# Altium schematic sheet M5_CORE2_re.SchDoc
size A2; SheetNumber: 1; SheetTotal: 1
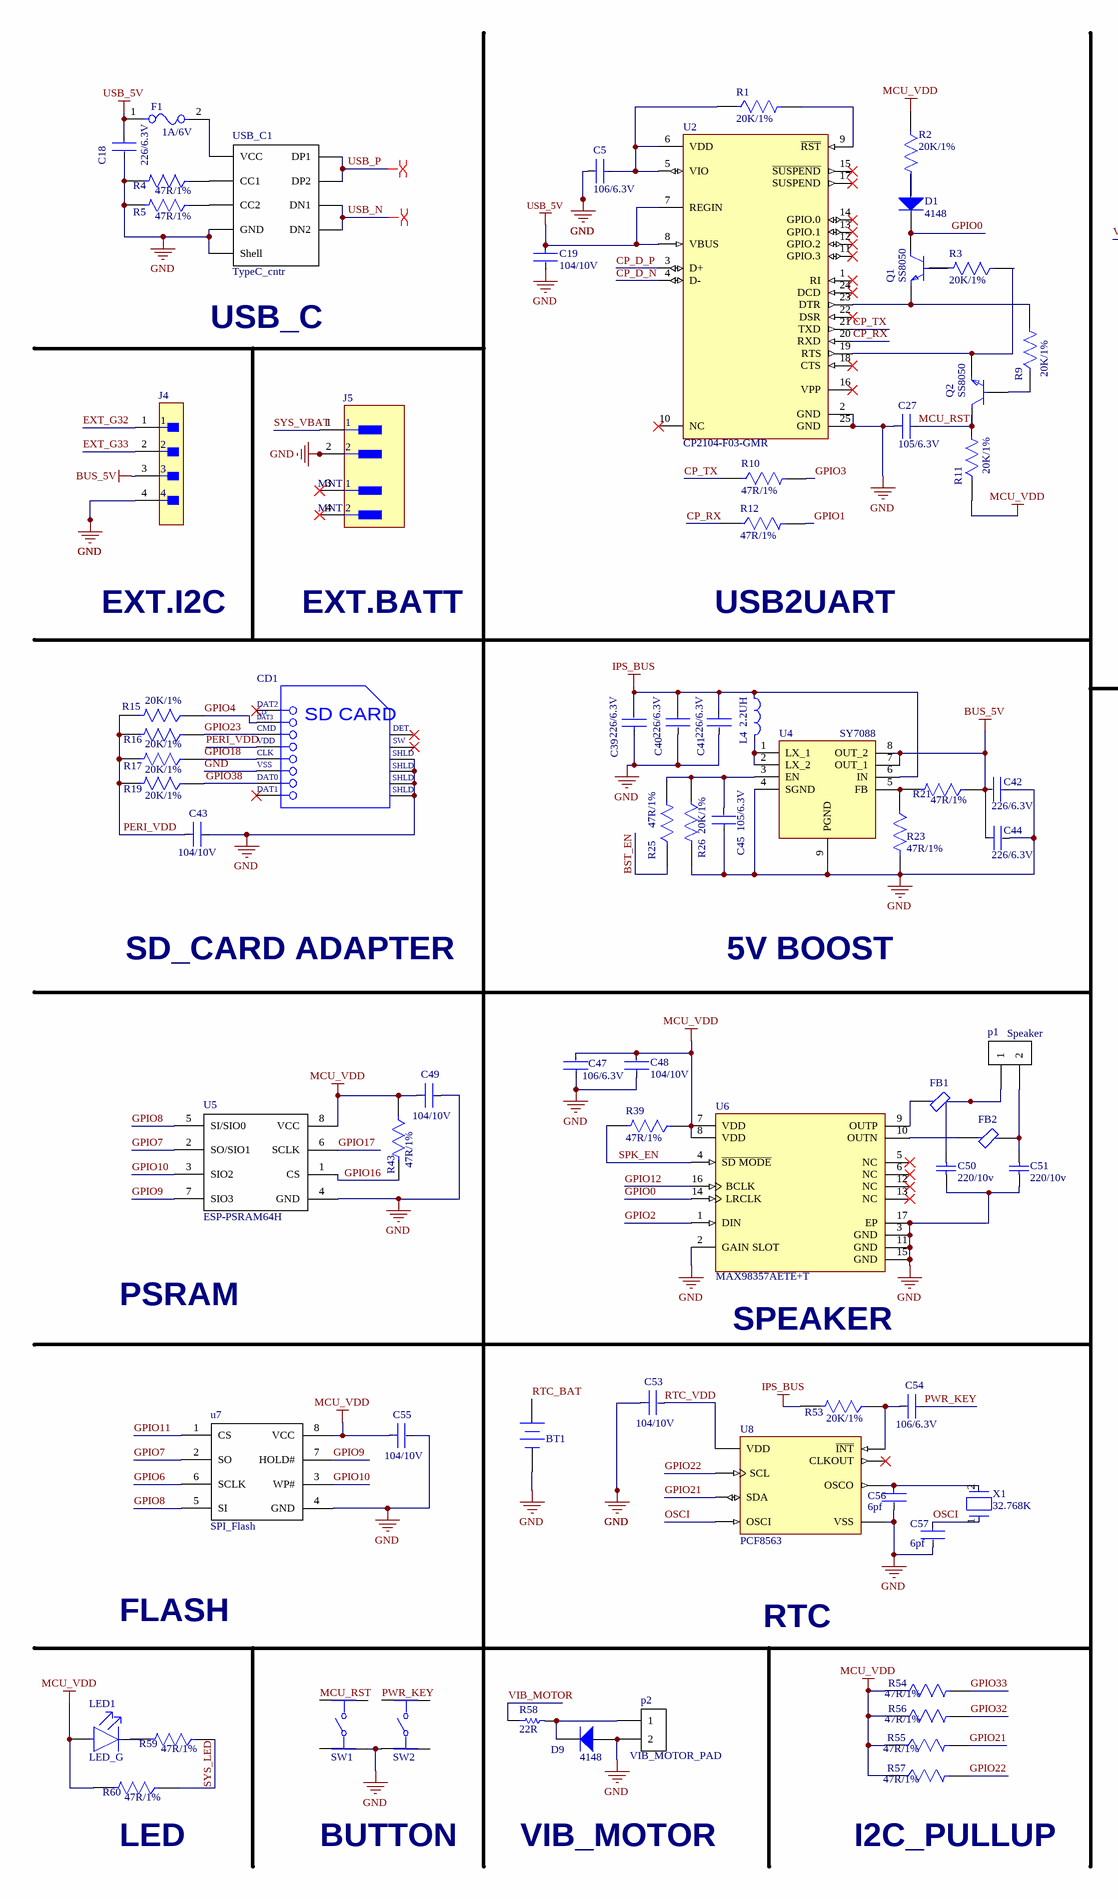
[diagram p0: M5_CORE2_re.SchDoc, left]
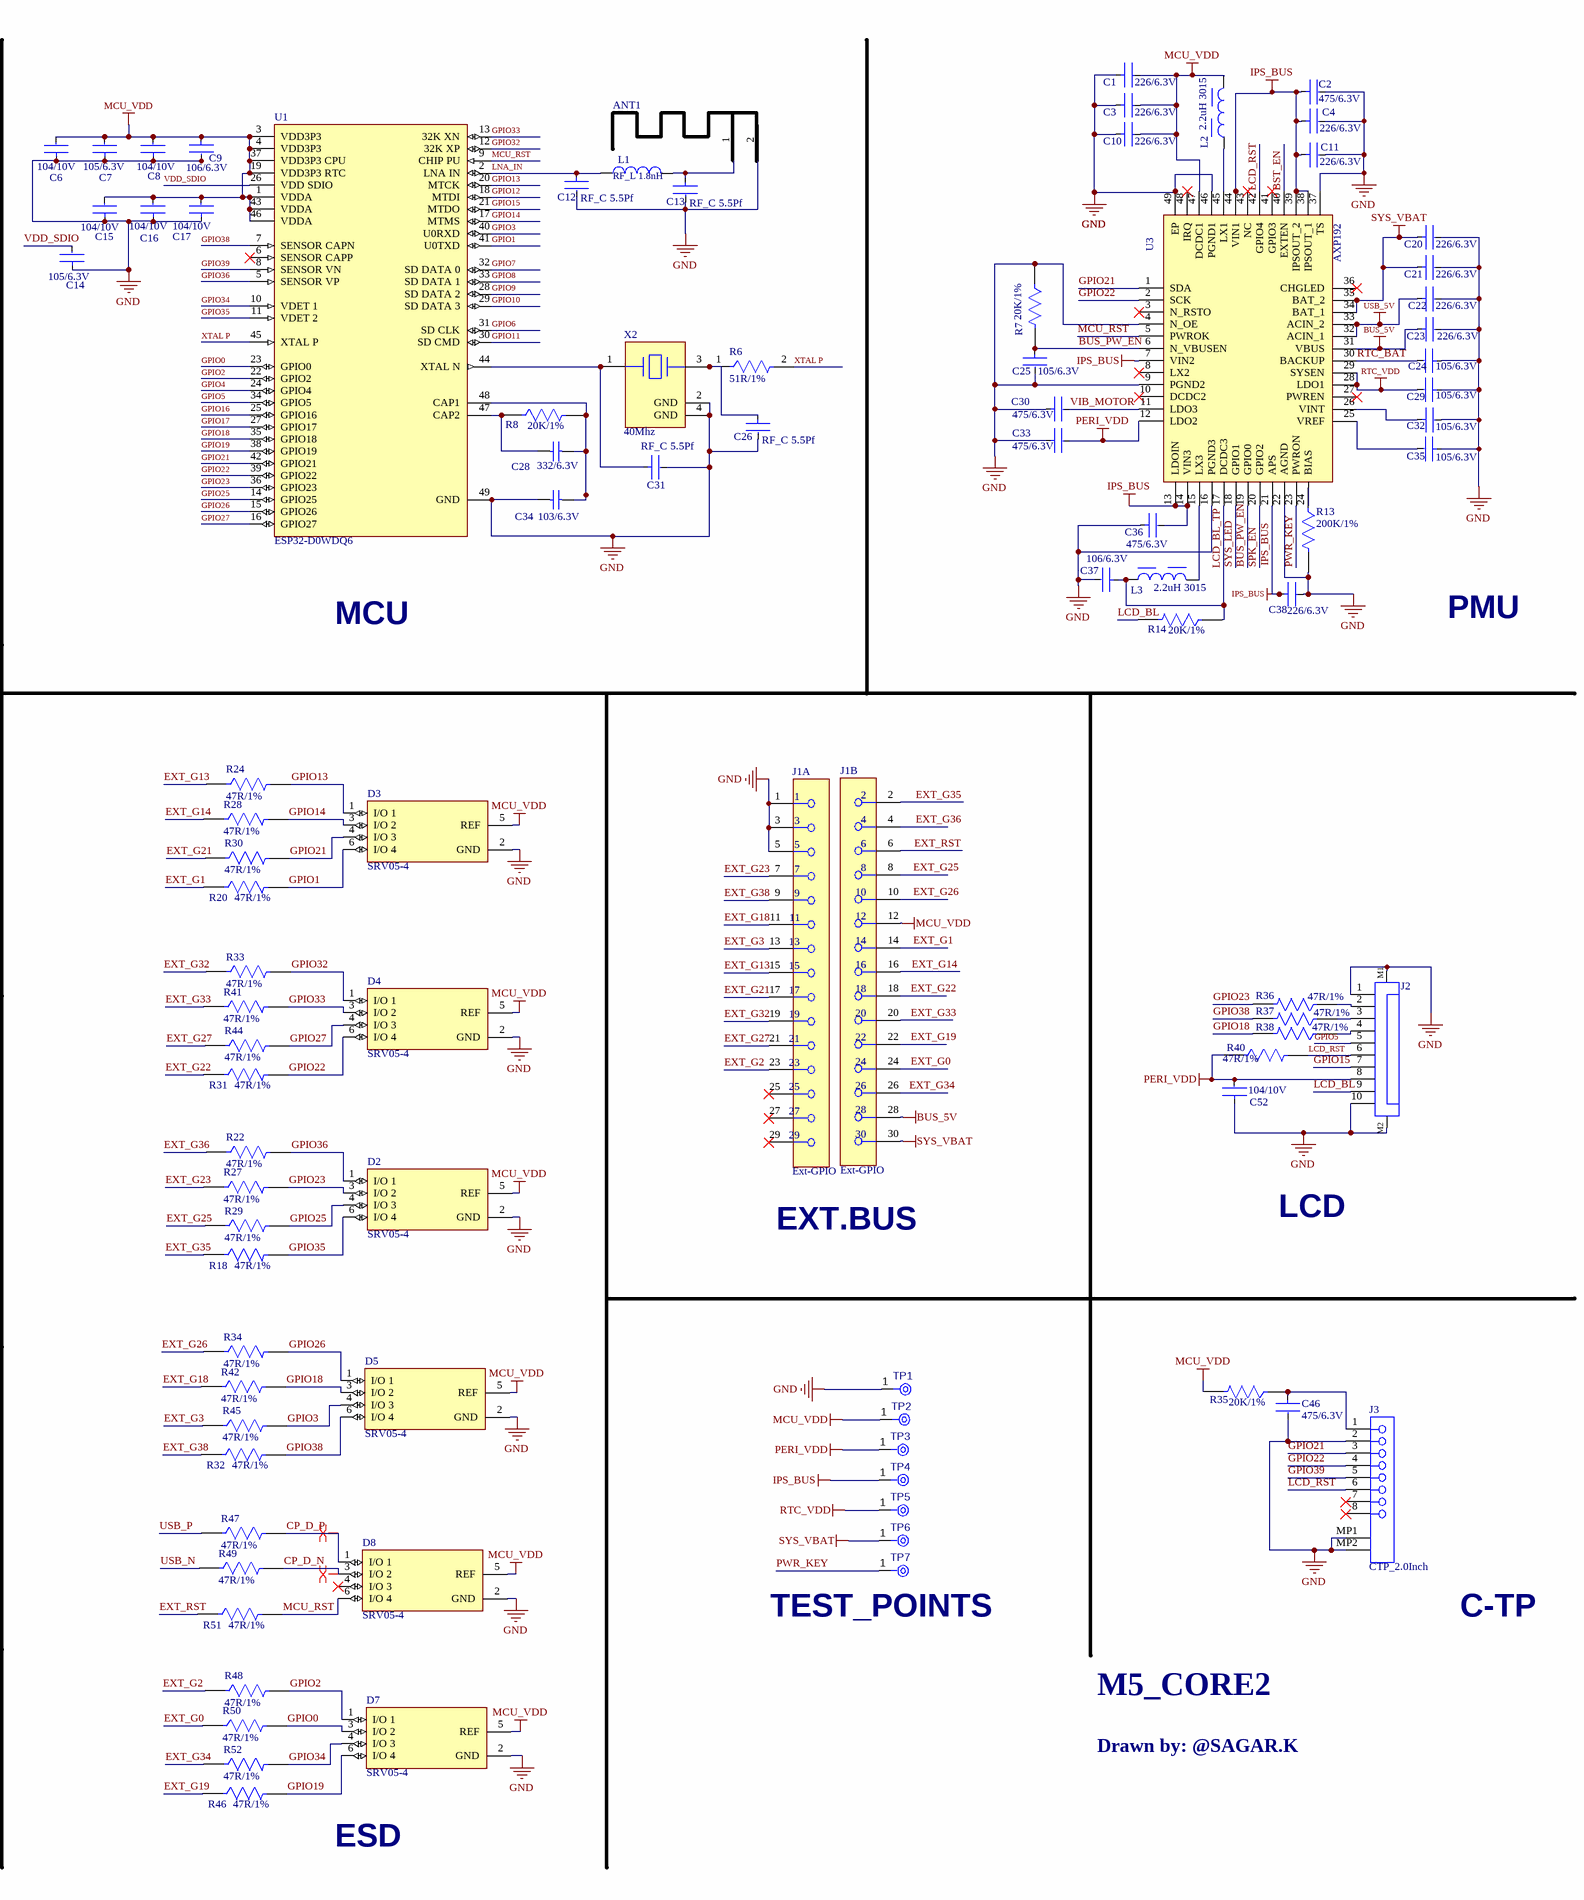
[diagram p1: M5_CORE2_re.SchDoc, right]

## Parts
ANT1  2.4GHz_PCB-Antenna  [2.4GHZ_PCB-Antenna]  (value not drawn)
BT1  MS621FE-FL11E  [SEIK-MS621FE-FL11E-2_V]  (value not drawn)
C1  226/6.3V  [FP-CL05A226MQ5N6J8-IPC_C]
C2  475/6.3V  [FP-GRM155-0_1-IPC_B]
C3  226/6.3V  [FP-CL05A226MQ5N6J8-IPC_C]
C4  226/6.3V  [FP-CL05A226MQ5N6J8-IPC_C]
C5  106/6.3V  [FP-GRM155-0_1-IPC_B]
C6  104/10V  [FP-C0402-BB-MFG]
C7  105/6.3V  [FP-C0402C105K9PACTU-MFG]
C8  104/10V  [FP-C0402-BB-MFG]
C9  106/6.3V  [FP-GRM155-0_2-IPC_B]
C10  226/6.3V  [FP-CL05A226MQ5N6J8-IPC_C]
C11  226/6.3V  [FP-CL05A226MQ5N6J8-IPC_C]
C12  RF_C 5.5Pf  [FP-GJM155-0_05-IPC_C]
C13  RF_C 5.5Pf  [FP-GJM155-0_05-IPC_C]
C14  105/6.3V  [FP-C0402C105K9PACTU-MFG]
C15  104/10V  [FP-C0402-BB-MFG]
C16  104/10V  [FP-C0402-BB-MFG]
C17  104/10V  [FP-C0402-BB-MFG]
C18  226/6.3V  [FP-CL05A226MQ5N6J8-IPC_C]
C19  104/10V  [FP-C0402-BB-MFG]
C20  226/6.3V  [FP-CL05A226MQ5N6J8-IPC_C]
C21  226/6.3V  [FP-CL05A226MQ5N6J8-IPC_C]
C22  226/6.3V  [FP-CL05A226MQ5N6J8-IPC_C]
C23  226/6.3V  [FP-CL05A226MQ5N6J8-IPC_C]
C24  105/6.3V  [FP-C0402C105K9PACTU-MFG]
C25  105/6.3V  [FP-C0402C105K9PACTU-MFG]
C26  RF_C 5.5Pf  [FP-GJM155-0_05-IPC_C]
C27  105/6.3V  [FP-C0402C105K9PACTU-MFG]
C28  332/6.3V  [CAPC1005X55X30LL05T10]
C29  105/6.3V  [FP-C0402C105K9PACTU-MFG]
C30  475/6.3V  [FP-GRM155-0_1-IPC_B]
C31  RF_C 5.5Pf  [FP-GJM155-0_05-IPC_C]
C32  105/6.3V  [FP-C0402C105K9PACTU-MFG]
C33  475/6.3V  [FP-GRM155-0_1-IPC_B]
C34  103/6.3V  [CAPC1005X55X30LL05T10]
C35  105/6.3V  [FP-C0402C105K9PACTU-MFG]
C36  475/6.3V  [FP-GRM155-0_1-IPC_B]
C37  106/6.3V  [FP-GRM155-0_1-IPC_B]
C38  226/6.3V  [FP-CL05A226MQ5N6J8-IPC_C]
C39  226/6.3V  [FP-CL05A226MQ5N6J8-IPC_C]
C40  226/6.3V  [FP-CL05A226MQ5N6J8-IPC_C]
C41  226/6.3V  [FP-CL05A226MQ5N6J8-IPC_C]
C42  226/6.3V  [FP-CL05A226MQ5N6J8-IPC_C]
C43  104/10V  [FP-C0402-BB-MFG]
C44  226/6.3V  [FP-CL05A226MQ5N6J8-IPC_C]
C45  105/6.3V  [FP-C0402C105K9PACTU-MFG]
C46  475/6.3V  [FP-GRM155-0_1-IPC_B]
C47  106/6.3V  [FP-GRM155-0_1-IPC_B]
C48  104/10V  [FP-C0402-BB-MFG]
C49  104/10V  [FP-C0402-BB-MFG]
C50  220/10v  [CAPC1005X56X25LL10T15]
C51  220/10v  [CAPC1005X56X25LL10T15]
C52  104/10V  [FP-C0402-BB-MFG]
C53  104/10V  [FP-C0402-BB-MFG]
C54  106/6.3V  [FP-GRM155-0_1-IPC_B]
C55  104/10V  [FP-C0402-BB-MFG]
C56  6pf  [FP-CGA2B-IPC_A]
C57  6pf  [FP-CGA2B-IPC_A]
CD1  502774-0891  [MOLX-502774-0891_V]  (value not drawn)
D1  4148  [FP-SOD323-MFG]
D2  SRV05-4  [FP-CDSOT23-SRV05-4-MFG]
D3  SRV05-4  [FP-CDSOT23-SRV05-4-MFG]
D4  SRV05-4  [FP-CDSOT23-SRV05-4-MFG]
D5  SRV05-4  [FP-CDSOT23-SRV05-4-MFG]
D7  SRV05-4  [FP-CDSOT23-SRV05-4-MFG]
D8  SRV05-4  [FP-CDSOT23-SRV05-4-MFG]
D9  4148  [FP-SOD323-MFG]
F1  1A/6V  [FP-0805L-MFG]
FB1  BLM15AG601SN1D  [FP-BLM15-0_05-MFG]  (value not drawn)
FB2  BLM15AG601SN1D  [FP-BLM15-0_05-MFG]  (value not drawn)
J1  Ext-GPIO  [FP-6-534206-5-MFG]  (parts A,B of 2)
J2  687110149022  [687110149022]  (value not drawn)
J3  CTP_2.0Inch  [MOLX-52745-0897]
J4  S4B-ZR(LF)(SN)  [FP-S4B-ZR_LF_SN-MFG]  (value not drawn)
J5  BM02B-SRSS-TBT(LF)(SN)  [FP-BM02B-SRSS-TBT_LF_SN-MFG]  (value not drawn)
L1  RF_L 1.8nH  [WE-TCI_0402]
L2  2.2uH 3015  [WE-MAPI_3015]
L3  2.2uH 3015  [WE-MAPI_3015]
L4  2.2UH  [FP-LQM2HPN_G0-IPC_C]
LED1  LED_G  [FP-SML-P1-MFG]
p1  Speaker  [2pin SMD pads]
p2  VIB_MOTOR_PAD  [2pin SMD pads]
Q1  SS8050  [FP-SS8050-G-MFG]
Q2  SS8050  [FP-SS8050-G-MFG]
R1  20K/1%  [FP-ERJ2RK-IPC_C]
R2  20K/1%  [FP-ERJ2RK-IPC_C]
R3  20K/1%  [FP-ERJ2RK-IPC_C]
R4  47R/1%  [FP-ERJ2RK-IPC_C]
R5  47R/1%  [FP-ERJ2RK-IPC_C]
R6  51R/1%  [FP-CR0402-IPC_A]
R7  20K/1%  [FP-ERJ2RK-IPC_C]
R8  20K/1%  [FP-ERJ2RK-IPC_C]
R9  20K/1%  [FP-ERJ2RK-IPC_C]
R10  47R/1%  [FP-ERJ2RK-IPC_C]
R11  20K/1%  [FP-ERJ2RK-IPC_C]
R12  47R/1%  [FP-ERJ2RK-IPC_C]
R13  200K/1%  [FP-RMCF0402-IPC_C]
R14  20K/1%  [FP-ERJ2RK-IPC_C]
R15  20K/1%  [FP-ERJ2RK-IPC_C]
R16  20K/1%  [FP-ERJ2RK-IPC_C]
R17  20K/1%  [FP-ERJ2RK-IPC_C]
R18  47R/1%  [FP-ERJ2RK-IPC_C]
R19  20K/1%  [FP-ERJ2RK-IPC_C]
R20  47R/1%  [FP-ERJ2RK-IPC_C]
R21  47R/1%  [FP-ERJ2RK-IPC_C]
R22  47R/1%  [FP-ERJ2RK-IPC_C]
R23  47R/1%  [FP-ERJ2RK-IPC_C]
R24  47R/1%  [FP-ERJ2RK-IPC_C]
R25  47R/1%  [FP-ERJ2RK-IPC_C]
R26  20K/1%  [FP-ERJ2RK-IPC_C]
R27  47R/1%  [FP-ERJ2RK-IPC_C]
R28  47R/1%  [FP-ERJ2RK-IPC_C]
R29  47R/1%  [FP-ERJ2RK-IPC_C]
R30  47R/1%  [FP-ERJ2RK-IPC_C]
R31  47R/1%  [FP-ERJ2RK-IPC_C]
R32  47R/1%  [FP-ERJ2RK-IPC_C]
R33  47R/1%  [FP-ERJ2RK-IPC_C]
R34  47R/1%  [FP-ERJ2RK-IPC_C]
R35  20K/1%  [FP-ERJ2RK-IPC_C]
R36  47R/1%  [FP-ERJ2RK-IPC_C]
R37  47R/1%  [FP-ERJ2RK-IPC_C]
R38  47R/1%  [FP-ERJ2RK-IPC_C]
R39  47R/1%  [FP-ERJ2RK-IPC_C]
R40  47R/1%  [FP-ERJ2RK-IPC_C]
R41  47R/1%  [FP-ERJ2RK-IPC_C]
R42  47R/1%  [FP-ERJ2RK-IPC_C]
R43  47R/1%  [FP-ERJ2RK-IPC_C]
R44  47R/1%  [FP-ERJ2RK-IPC_C]
R45  47R/1%  [FP-ERJ2RK-IPC_C]
R46  47R/1%  [FP-ERJ2RK-IPC_C]
R47  47R/1%  [FP-ERJ2RK-IPC_C]
R48  47R/1%  [FP-ERJ2RK-IPC_C]
R49  47R/1%  [FP-ERJ2RK-IPC_C]
R50  47R/1%  [FP-ERJ2RK-IPC_C]
R51  47R/1%  [FP-ERJ2RK-IPC_C]
R52  47R/1%  [FP-ERJ2RK-IPC_C]
R53  20K/1%  [FP-ERJ2RK-IPC_C]
R54  47R/1%  [FP-ERJ2RK-IPC_C]
R55  47R/1%  [FP-ERJ2RK-IPC_C]
R56  47R/1%  [FP-ERJ2RK-IPC_C]
R57  47R/1%  [FP-ERJ2RK-IPC_C]
R58  22R  [RESC1005X40X25LL05T10]
R59  47R/1%  [FP-ERJ2RK-IPC_C]
R60  47R/1%  [FP-ERJ2RK-IPC_C]
SW1  EVQ-PUC02K  [FP-EVQ-PUC02K-MFG]  (value not drawn)
SW2  EVQ-PUC02K  [FP-EVQ-PUC02K-MFG]  (value not drawn)
TP1  TPAD6R  [TP06R]  (value not drawn)  (no BOM)
TP2  TPAD6R  [TP06R]  (value not drawn)  (no BOM)
TP3  TPAD6R  [TP06R]  (value not drawn)  (no BOM)
TP4  TPAD6R  [TP06R]  (value not drawn)  (no BOM)
TP5  TPAD6R  [TP06R]  (value not drawn)  (no BOM)
TP6  TPAD6R  [TP06R]  (value not drawn)  (no BOM)
TP7  TPAD6R  [TP06R]  (value not drawn)  (no BOM)
U1  ESP32-D0WDQ6  [FP-ESP32-D0WDQ6-IPC_C]
U2  CP2104-F03-GMR  [FP-CP2104-F03-GMR-MFG]
U3  AXP192  [AXP192]
U4  SY7088  [SY7088]
U5  ESP-PSRAM64H  [ESP-PSRAM64H]
U6  MAX98357AETE+T  [FP-T1633-4-MFG]
u7  SPI_Flash  [SPI_Flash_MT25QL128ABA1ESE-0SIT]
U8  PCF8563  [FP-SOT96-1-MFG]
USB_C1  TypeC_cntr  [TypeC]
X1  32.768K  [FP-ABS06-MFG]
X2  40Mhz  [FP-ABM8-MFG]

## Nets
BUS_5V: C23.1 C42.2 C44.1 J1.28 J4.3 R21.1 U3.31(VBUS) U4.7(OUT_1) U4.8(OUT_2)
GND: ANT1.2(GND) BT1.2(-) C1.1 C2.2 C3.1 C4.2 C5.2 C6.1 C7.1 C8.1 C9.2 C10.1 C11.2 C12.2 C13.2 C14.1 C15.1 C16.1 C17.1 C18.2 C19.2 C20.2 C21.2 C22.2 C23.2 C24.1 C25.2 C26.2 C27.1 C29.1 C30.1 C31.2 C32.2 C33.1 C34.1 C35.1 C36.1 C37.2 C38.2 C39.1 C40.2 C41.2 C42.1 C43.2 C44.2 C45.1 C46.2 C47.1 C48.1 C49.2 C50.2 C51.1 C52.1 C53.1 C55.2 C56.2 C57.2 CD1.6(VSS) CD1.11(SHLD) CD1.12(SHLD) CD1.13(SHLD) CD1.14(SHLD) D2.2(GND) D3.2(GND) D4.2(GND) D5.2(GND) D7.2(GND) D8.2(GND) D9.2(A) J1.1 J1.3 J1.5 J2.1 J2.10 J2.M1 J2.M2 J3.2 J3.MP1 J3.MP2 J4.4 J5.2 p2.2 R4.2 R5.2 R7.1 R13.2 R23.2 R26.2 SW1.3 SW2.1 TP1.1(TP) U1.49(GND) U2.2(GND) U2.25(GND) U3.4(N_OE) U3.9(PGND2) U3.16(PGND3) U3.22(AGND) U3.37(TS) U3.46(PGND1) U3.49(EP) U4.4(SGND) U4.9(PGND) U5.4(GND) U6.2(GAIN_SLOT) U6.3(GND) U6.11(GND) U6.15(GND) U6.17(EP) u7.4(GND) U8.4(VSS) USB_C1.A1(GND) USB_C1.A12(Shell) X2.2(GND) X2.4(GND)
IPS_BUS: C2.1 C4.1 C11.1 C36.2 C38.1 C39.2 C40.1 C41.1 L4.1 R53.2 TP4.1(TP) U3.7(VIN2) U3.13(LDOIN) U3.14(VIN3) U3.21(APS) U3.38(IPSOUT_1) U3.39(IPSOUT_2) U3.44(VIN1) U4.6(IN)
MCU_VDD: C1.2 C3.2 C6.2 C7.2 C8.2 C9.1 C10.2 C15.2 C16.2 C17.2 C47.2 C48.2 C49.1 C55.1 D2.5(REF) D3.5(REF) D4.5(REF) D5.5(REF) D7.5(REF) D8.5(REF) J1.12 L2.2 LED1.2(A) R2.1 R11.1 R35.2 R39.1 R43.1 R54.1 R55.1 R56.1 R57.1 R60.2 TP2.1(TP) U1.1(VDDA) U1.3(VDD3P3) U1.4(VDD3P3) U1.19(VDD3P3_RTC) U1.37(VDD3P3_CPU) U1.43(VDDA) U1.46(VDDA) U3.47(DCDC1) U5.8(VCC) U6.7(VDD) U6.8(VDD) u7.8(VCC)
PERI_VDD: C33.2 C43.1 C52.2 CD1.4(VDD) J2.8 R15.2 R16.2 R17.2 R19.2 R40.1 TP3.1(TP) U3.12(LDO2)
RTC_VDD: C29.2 C53.2 TP5.1(TP) U3.28(LDO1) U3.29(SYSEN) U8.8(VDD)
SYS_VBAT: C20.1 C21.1 J1.30 J5.1 TP6.1(TP) U3.34(BAT_1) U3.35(BAT_2)
USB_5V: C18.1 C19.1 C22.1 F1.1 U2.7(REGIN) U2.8(VBUS) U3.32(ACIN_1) U3.33(ACIN_2)
BST_EN: R25.1 U3.40(EXTEN)
BUS_PW_EN: C25.1 R7.2 U3.6(N_VBUSEN) U3.19(GPIO0)
CP_D_N: D8.3(I/O_2) R49.2 U2.4(D-)
CP_D_P: D8.1(I/O_1) R47.2 U2.3(D+)
CP_RX: R12.1 U2.20(RXD)
CP_TX: R10.1 U2.21(TXD)
EXT_G0: J1.24 R50.1
EXT_G1: J1.14 R20.1
EXT_G2: J1.23 R48.1
EXT_G3: J1.13 R45.1
EXT_G13: J1.15 R24.1
EXT_G14: J1.16 R28.1
EXT_G18: J1.11 R42.1
EXT_G19: J1.22 R46.1
EXT_G21: J1.17 R30.1
EXT_G22: J1.18 R31.1
EXT_G23: J1.7 R27.1
EXT_G25: J1.8 R29.1
EXT_G26: J1.10 R34.1
EXT_G27: J1.21 R44.1
EXT_G32: J1.19 J4.1 R33.1
EXT_G33: J1.20 J4.2 R41.1
EXT_G34: J1.26 R52.1
EXT_G35: J1.2 R18.1
EXT_G36: J1.4 R22.1
EXT_G38: J1.9 R32.1
EXT_RST: J1.6 R51.1
GPIO0: D1.1(K) D7.3(I/O_2) Q1.3(C) R50.2 U1.23(GPIO0) U6.14(LRCLK)
GPIO1: D3.6(I/O_4) R12.2 R20.2 U1.41(U0TXD)
GPIO2: D7.1(I/O_1) R48.2 U1.22(GPIO2) U6.1(DIN)
GPIO3: D5.4(I/O_3) R10.2 R45.2 U1.40(U0RXD)
GPIO4: CD1.2(CD/DAT3) R15.1 U1.24(GPIO4)
GPIO5: J2.5 U1.34(GPIO5)
GPIO6: U1.31(SD_CLK) u7.6(SCLK)
GPIO7: U1.32(SD_DATA_0) U5.2(SO/SIO1) u7.2(SO)
GPIO8: U1.33(SD_DATA_1) U5.5(SI/SIO0) u7.5(SI)
GPIO9: U1.28(SD_DATA_2) U5.7(SIO3) u7.7(HOLD#)
GPIO10: U1.29(SD_DATA_3) U5.3(SIO2) u7.3(WP#)
GPIO11: U1.30(SD_CMD) u7.1(CS)
GPIO12: U1.18(MTDI) U6.16(BCLK)
GPIO13: D3.1(I/O_1) R24.2 U1.20(MTCK)
GPIO14: D3.3(I/O_2) R28.2 U1.17(MTMS)
GPIO15: J2.7 U1.21(MTDO)
GPIO16: R43.2 U1.25(GPIO16) U5.1(CS)
GPIO17: U1.27(GPIO17) U5.6(SCLK)
GPIO18: CD1.5(CLK) D5.3(I/O_2) R17.1 R38.2 R42.2 U1.35(GPIO18)
GPIO19: D7.6(I/O_4) R46.2 U1.38(GPIO19)
GPIO21: D3.4(I/O_3) J3.3 R30.2 R55.2 U1.42(GPIO21) U3.1(SDA) U8.5(SDA)
GPIO22: D4.6(I/O_4) J3.4 R31.2 R57.2 U1.39(GPIO22) U3.2(SCK) U8.6(SCL)
GPIO23: CD1.3(CMD) D2.3(I/O_2) R16.1 R27.2 R36.2 U1.36(GPIO23)
GPIO25: D2.4(I/O_3) R29.2 U1.14(GPIO25)
GPIO26: D5.1(I/O_1) R34.2 U1.15(GPIO26)
GPIO27: D4.4(I/O_3) R44.2 U1.16(GPIO27)
GPIO32: D4.1(I/O_1) R33.2 R56.2 U1.12(32K_XP)
GPIO33: D4.3(I/O_2) R41.2 R54.2 U1.13(32K_XN)
GPIO34: D7.4(I/O_3) R52.2 U1.10(VDET_1)
GPIO35: D2.6(I/O_4) R18.2 U1.11(VDET_2)
GPIO36: D2.1(I/O_1) R22.2 U1.5(SENSOR_VP)
GPIO38: CD1.7(DAT0) D5.6(I/O_4) R19.1 R32.2 R37.2 U1.7(SENSOR_CAPN)
GPIO39: J3.5 U1.8(SENSOR_VN)
LCD_BL: J2.9 R14.2
LCD_BL_TP: C37.1 L3.1 R14.1 U3.17(DCDC3)
LCD_RST: J2.6 J3.6 R40.2 U3.42(GPIO4)
LNA_IN: C12.1 L1.1 U1.2(LNA_IN)
MCU_RST: C27.2 D8.6(I/O_4) Q2.3(C) R11.2 R51.2 SW1.2 U1.9(CHIP_PU) U3.5(PWROK)
OSCI: C57.1 U8.1(OSCI) X1.1
PWR_KEY: C54.1 SW2.2 TP7.1(TP) U3.23(PWRON)
RTC_BAT: BT1.1(+) C24.2 U3.30(BACKUP)
SPK_EN: R39.2 U3.20(GPIO2) U6.4(~{SD_MODE})
SYS_LED: R59.1 R60.1 U3.18(GPIO1)
USB_N: R49.1 USB_C1.A7(DN1) USB_C1.B7(DN2)
USB_P: R47.1 USB_C1.A6(DP1) USB_C1.B6(DP2)
VDD_SDIO: C14.2 U1.26(VDD_SDIO)
VIB_MOTOR: C30.2 R58.1 U3.11(LDO3)
XTAL P: R6.2 U1.45(XTAL_P)
NetANT1_1: ANT1.1(ANT_IN) C13.1 L1.2
NetC5_1: C5.1 R1.1 U2.5(VIO) U2.6(VDD)
NetC26_1: C26.1 R6.1 X2.3
NetC28_1: C28.1 R8.1 U1.47(CAP2)
NetC28_2: C28.2 C34.2 R8.2 U1.48(CAP1)
NetC31_1: C31.1 U1.44(XTAL_N) X2.1
NetC32_1: C32.1 U3.26(VINT)
NetC35_2: C35.2 U3.25(VREF)
NetC45_2: C45.2 R25.2 R26.1 U4.3(EN)
NetC46_1: C46.1 J3.1 R35.1
NetC50_1: C50.1 FB1.2 p1.1
NetC51_2: C51.2 FB2.2 p1.2
NetC54_2: C54.2 R53.1 U8.3(~{INT})
NetC56_1: C56.1 U8.2(OSCO) X1.2
NetD1_2: D1.2(A) R2.2
NetD9_1: D9.1(K) p2.1 R58.2
NetF1_2: F1.2 USB_C1.A4(VCC)
NetFB1_1: FB1.1 U6.9(OUTP)
NetFB2_1: FB2.1 U6.10(OUTN)
NetJ2_2: J2.2 R36.1
NetJ2_3: J2.3 R37.1
NetJ2_4: J2.4 R38.1
NetL2_1: L2.1 U3.45(LX1)
NetL3_2: L3.2 U3.15(LX3)
NetL4_2: L4.2 U4.1(LX_1) U4.2(LX_2)
NetLED1_1: LED1.1(C) R59.2
NetQ1_1: Q1.1(B) R3.2
NetQ1_2: Q1.2(E) R9.2 U2.23(DTR)
NetQ2_1: Q2.1(B) R9.1
NetQ2_2: Q2.2(E) R3.1 U2.19(RTS)
NetR1_2: R1.2 U2.9(~{RST})
NetR4_1: R4.1 USB_C1.A5(CC1)
NetR5_1: R5.1 USB_C1.B5(CC2)
NetR13_1: R13.1 U3.24(BIAS)
NetR21_2: R21.2 R23.1 U4.5(FB)

Not connected (* = marked no-connect by the designer): CD1 1(DAT2)* 8(DAT1)* 9(DETECT)* 10(SWITCH)*; D8 4(I/O_3)*; J1 25* 27* 29*; J3 7* 8*; J5 3(MNT_1)* 4(MNT_2)*; SW1 1 4; SW2 3 4; U1 6(SENSOR_CAPP)*; U2 1(RI)* 10(NC)* 11(GPIO.3)* 12(GPIO.2)* 13(GPIO.1)* 14(GPIO.0)* 15(~{SUSPEND})* 16(VPP)* 17(SUSPEND)* 18(CTS)* 22(DSR)* 24(DCD)*; U3 3(N_RSTO)* 8(LX2)* 10(DCDC2)* 27(PWREN)* 36(CHGLED)* 41(GPIO3)* 43(NC)* 48(IRQ)*; U6 5(NC)* 6(NC)* 12(NC)* 13(NC)*; U8 7(CLKOUT)*

## Layout directives
differential pair: CP_D_N, CP_D_P, USB_N, USB_P

## Notes on the sheet
- (near USB_C1) USB_C
- EXT.I2C
- EXT.BATT
- USB2UART
- MCU
- PMU
- SD_CARD ADAPTER
- 5V BOOST
- EXT.BUS
- LCD
- PSRAM
- (near U6) SPEAKER
- (near TP7) TEST_POINTS
- C-TP
- FLASH
- RTC
- M5_CORE2
- Drawn by: @SAGAR.K
- (near R60) LED
- BUTTON
- VIB_MOTOR
- (near R57) I2C_PULLUP
- ESD
- (in symbol CMP-2000-05248-1) CD/; DAT3; SD CARD; DET; SW

## Library data of the parts
ANT1 = 2.4GHz_PCB-Antenna: Generic symbol for PCB Antenna,; Frequency: 2.4GHz; Reference: https://www.ti.com/lit/an/swra117d/swra117d.pdf
BT1 = CMP-2000-05342-1: MS Lihium Rechargeable Battery, 3 V, -20 to 60 degC, Tray; Manufacturer: SeikoInstruments; Brand: SeikoInstrumentsMicroEnergy; Output Voltage: 3V; Capacity: 5.5mAh; Chemistry: Lithium; Battery Size: 621; Unit Weight: 0.008113oz; Datasheet URL: http://datasheet.octopart.com/MS621FE-FL11E-Seiko-datasheet-5320152.pdf; Rechargeable/Non-Rechargeable: Rechargeable; Orientation: Vertical; Height: 2.1mm; Series: MS; Datasheet Version: Jan-08; Type: CoinCellBatterywithLeads; Diameter: 6.8mm; Mounting Style: WithLeads; Product Category: CoinCellBattery; Termination Style: ThroughHole; Packaging: Tray; Manufacturer URL: http://www.sii.co.jp/en/; RoHS: NotApplicable; Factory Pack Quantity: 100
C1 C3 C4 C10 C11 C18 C20-C23 C38-C42 C44 = CMP-13271-000001-1: CAP CER 22UF 6.3V X5R 0402; Manufacturer Part Number: CL05A226MQ5N6J8; Manufacturer: Samsung; Material: Ceramic; Temperature Coefficient: 15%; Tolerance: 20%; Ipc Land Pattern Name: CAPC10050X50; Lead Free: Yes; Temperature Characteristic: X5R; Temperature: -55°C to +85°C; RoHS: TRUE; ComponentLink2Description: Datasheet; Device Class L3: Ceramic Capacitors; Device Class L1: Passive Components; Value: 22uF; Temperature Range High: +85°C; Automotive: No; Voltage Rating: 6.3V; Package: 0402; Category: Cap; Device Class L2: Capacitors; Height: 0.55mm; ComponentLink2URL: http://www.samsungsem.com/kr/support/library/product-catalog/__icsFiles/afieldfile/2018/11/28/MLCC.pdf; Temperature Range Low: -55°C; Octopart: https://octopart.com/cl05a226mq5n6j8-samsung-82337113; Capacitance: 22uF; Digikey Description: CAP CER 22UF 6.3V X5R 0402
C2 C30 C33 C36 C46 = CMP-2008-04549-2: Chip Multilayer Ceramic Capacitors for General Purpose, 0402, 4.7uF, X5R, 15%, 20%, 6.3V; Manufacturer: Murata; Manufacturer Part Number: GRM155R60J475ME47D; Height: 0.5mm; Weight: 0.000212oz; Length: 1mm; Case Code (Metric): 1005; Packaging: Tape and Reel; Termination: SMD/SMT; Dielectric: X5R; Depth: 0.5mm; Case Code (Imperial): 0402; Min Operating Temperature: -55°C; Case/Package: 0402; Voltage: 6.3V; Width: 0.02inch; Capacitance: 4.7uF; Lead Free: Lead Free; Thickness: 0.022inch; Contact Plating: Tin; REACH SVHC: No SVHC; Package Quantity: 10000; Tolerance: 20%; Voltage Rating (DC): 6.3V; Voltage Rating: 6.3V; Mount: Surface Mount; Max Operating Temperature: 85°C
C5 C37 C47 C54 = CMP-2006-02285-3: CAP CER 10UF 6.3V X5R 0603; Manufacturer Part Number: C0603C106M9PACTU; Manufacturer: KEMET; Material: Ceramic; Temperature Coefficient: 15%; Tolerance: 20%; Category: Cap; Height: 0.9mm; Digikey Description: CAP CER 10UF 6.3V X5R 0603; Mouser Description: In a Pack of 10, KEMET 0603 (1608M) 10µF MLCC 6.3V dc ±20% SMD C0603C106M9PACTU; Voltage Rating: 6.3V; Device Class L2: Capacitors; Temperature Range Low: -55°C; Temperature Characteristic: X5R; ComponentLink2Description: Datasheet; Ipc Land Pattern Name: CAPC16080X80; ComponentLink2URL: http://www.kemet.com/Lists/ProductCatalog/Attachments/19/KEM_C1006_X5R_SMD.pdf; Capacitance: 10uF; Temperature Range High: +85°C; Device Class L3: Ceramic Capacitors; RoHS: TRUE; Automotive: No; Value: 10uF; Temperature: -55°C to +85°C; Device Class L1: Passive Components; Package: C0603C106M9PACTU; Lead Free: Yes; Octopart: https://octopart.com/c0603c106m9pactu-kemet-8375727
C6 C8 C15-C17 C19 C43 C48 C49 C52 C53 C55 = CMP-2008-02046-2: CAP CER 0.1UF 10V X5R 0402; Manufacturer: KEMET; Manufacturer Part Number: C0402C104K8PACTU; Material: Ceramic; Capacitance: 0.10 μF; Temperature Coefficient: 15%; Tolerance: 0.1; Value: 0.10 μF; Package: C0402-BB; Temperature: -55°C to +125°C; ComponentLink2Description: Datasheet; Temperature Characteristic: X5R; Device Class L1: Passive Components; Height: 0.55mm; Lead Free: Yes; ComponentLink2URL: https://content.kemet.com/datasheets/KEM_C1002_X7R_SMD.pdf; Device Class L2: Capacitors; Temperature Range Low: -55°C; Temperature Range High: +125°C; RoHS: TRUE; Octopart: https://octopart.com/c0402c104k8pactu-kemet-140039; Automotive: No; Mouser Description: Capacitor 100 nF 10 VDC 0402; Category: Cap; Voltage Rating: 10 V; Digikey Description: CAP CER 0.1UF 10V X5R 0402; Ipc Land Pattern Name: CAPC10050X50; Device Class L3: Ceramic Capacitors
C7 C14 C24 C25 C27 C29 C32 C35 C45 = CMP-2008-02075-2: CAP CER 1UF 6.3V X5R 0402; Manufacturer: KEMET; Manufacturer Part Number: C0402C105K9PACTU; Tolerance: 10%; Dielectric Material: Ceramic; Series: C; Lead Free: Lead Free; Min Operating Temperature: -55°C; Capacitance: 1uF; Voltage Rating (DC): 6.3V; Number of Pins: 2; REACH SVHC: No SVHC; Mount: Surface Mount; Lead Pitch: 0.3mm; Case Code (Imperial): 0402; RoHS Compliant: Yes; Radiation Hardening: No; Construction: Flat; Depth: 0.5mm; Case/Package: 0402; Termination: SMD/SMT; Height: 0.5mm; Thickness: 0.022inch; Voltage: 6.3V; Dielectric: X5R; Width: 0.02inch; Voltage Rating: 6.3V; Max Operating Temperature: 85°C; Packaging: Tape and Reel; Package Quantity: 1; Length: 1mm
C9 = CMP-2000-05265-2: CAP CER 10UF 6.3V X5R 0402; Manufacturer: Murata; Manufacturer Part Number: GRM155R60J106ME44D; Tolerance: 20%; Voltage Rating: 6.3V; Voltage Rating (DC): 6.3V; Voltage: 6.3V; Case Code (Metric): 1005; REACH SVHC: No SVHC; Min Operating Temperature: -55°C; Height: 0.5mm; Dielectric: X5R; Depth: 0.5mm; Thickness: 0.022inch; Packaging: Tape and Reel; Length: 1mm; Mount: Surface Mount; Package Quantity: 10000; Lead Free: Lead Free; Case/Package: 0402; Termination: SMD/SMT; Max Operating Temperature: 85°C; Case Code (Imperial): 0402; Series: GRM; Capacitance: 10uF; Width: 0.5mm; RoHS Compliant: Yes
C12 C13 C26 C31 = CMP-06035-038280-1: Multi-Layer Ceramic Capacitor 5.5pF C0G  ±0.05pF 0402 Paper T/R; Manufacturer: Murata; Manufacturer Part Number: GJM1555C1H5R5WB01D; Voltage Rating (DC): 50V; Radiation Hardening: No; Length: 0.039inch; Min Operating Temperature: -55°C; Dielectric: C0G; Thickness: 0.022inch; Case/Package: 0402; Voltage Rating: 50V; Packaging: Tape and Reel; Height: 0.5mm; Case Code (Metric): 1005; Capacitance: 5.5pF; Max Operating Temperature: 125°C; Termination: SMD/SMT; Package Quantity: 10000; Width: 0.02inch; Depth: 0.5mm; Mount: Surface Mount; Case Code (Imperial): 0402
C28 = CMP-1034-01766-2: Part Number: C0402C332K9RACTU; Manufacturer: KEMET; Manufacturer Part Number: C0402C332K9RAC
C34 = CMP-1034-01868-2: Manufacturer: KEMET; Part Number: C0402C103K9RACTU; Manufacturer Part Number: C0402C103K9RAC
C50 C51 = CMP-2008-02969-1: Part Number: 0402ZC221KAT2A; Manufacturer: Kyocera AVX; Manufacturer Part Number: 0402ZC221KAT2A
C56 C57 = CMP-08246-001536-1: Cap Ceramic 6pF 50V C0G 0.5pF Pad SMD 0402 +125°C Automotive T/R; Manufacturer: TDK; Manufacturer Part Number: CGA2B2C0G1H060D050BA; Packaging: Tape and Reel; Weight: 2.3E-05oz; Max Operating Temperature: 125°C; Dielectric: C0G; Capacitance: 6pF; Voltage Rating: 50V; Ratings: AEC-Q200; Voltage Rating (DC): 50V; Mount: Surface Mount; REACH SVHC: No SVHC; Height: 0.5mm; Case/Package: 0402; Min Operating Temperature: -55°C; Termination: SMD/SMT; Length: 1mm; Width: 0.02inch; Case Code (Imperial): 0402; Thickness: 0.022inch; Case Code (Metric): 1005; Composition: Ceramic; Depth: 0.5mm; Package Quantity: 1
CD1 = CMP-2000-05248-1: Micro SD Memory Card Connector, 0.5 A, 10 V (DC), -25 to 85 degC, 8-Pin SMT, RoHS, Tape and Reel; Manufacturer: Molex; 3D Model: 502774-0891.stp; Online Catalog: microSD™Series; Number of Positions: 10(8+2); Card Type: SecureDigital-microSD™; Insertion, Removal Method: PushIn,PushOut; Other Names: WM24066DKR; Connector Type: ConnectorandEjector; Features: Switch; Family: MemoryConnectors-PCCardSockets; Manufacturer URL: http://www.molex.com/; Mounting Type: SurfaceMount,RightAngle; Contact Finish Thickness: 20µin(0.51µm); Standard Package: 1; Series: 502774; Ejector Side: -; Datasheet Version: Rev. D, 04/2004; Category: Connectors,Interconnects; Contact Finish: Gold; Datasheet URL: https://datasheet.ciiva.com/1104/1499551-1104671.pdf; RoHS Information: 502774-0891CertofCompliance; Mounting Feature: Reverse-Bottom; Packaging: Digi-Reel; Height Above Board: 0.071"(1.80mm); Catalog Drawings: 502774-0891
D1 D9 = CMP-0895-00001-2: Switching Diode, 2-Pin SOD-123, Pb-Free, Tape and Reel; PartNumber: MMSD4148T1G; Manufacturer: ON Semiconductor; trr Max (ns): 4; IF Max (A): 0.2; Configuration: Single; Mounting Technology: Surface Mount; ComponentLink2URL: http://www.onsemi.com/pub_link/Collateral/MMSD4148T1-D.PDF; ComponentLink1Description: Manufacturer URL; ComponentLink1URL: http://www.onsemi.com/; ComponentLink2Description: Datasheet; PackageDescription: 2-Pin SOD, Body 1.6 x 2.69 mm; Packing: Tape and Reel; DatasheetVersion: Rev. 11; PackageReference: SOD-123-2-425-04; ComponentLink3Description: Package Specification; ComponentLink3URL: http://www.onsemi.com/pub_link/Collateral/425-04.PDF; PackageVersion: Rev. G, 10/2009; RoHS: TRUE; Manufacturer Part Number: MMSD4148T1G
D2-D5 D7 D8 = CMP-07401-000007-1: TVS DIODE 5V 15V SOT23-6; Manufacturer Part Number: CDSOT23-SRV05-4; Manufacturer: Bourns; Standoff Height: 0.2mm; Direction: Bidirectional; Peak Pulse Power: 500W; Max Junction Temp: +150°C; Number Of Channels: 4; Breakdown Voltage: 6V; Peak Pulse Current: 30A; Temperature Range High: +150°C; RoHS: TRUE; Category: Diode; Clamping Voltage: 15V; Reverse Standoff Voltage: 5V; Octopart: https://octopart.com/cdsot23-srv05-4-bourns-1679449; Automotive: No; ComponentLink2URL: https://www.bourns.com/docs/Product-Datasheets/CDSOT23-SRV05-4.pdf; Device Class L1: Circuit Protection; Temperature: -55°C to +150°C; Device Class L2: TVS Diodes; Temperature Range Low: -55°C; Lead Free: Yes; Device Class L3: unset; Height: 1.45mm; Package: CDSOT23-SRV05-4; Ipc Land Pattern Name: SOT95P280X118-6; Mouser Description: CDSOT23-SRV05-4, Quad Uni-Directional TVS Diode, 500W, 6-Pin SOT-23; ComponentLink2Description: Datasheet; Digikey Description: TVS DIODE 5V 15V SOT23-6
F1 = CMP-08606-000023-1: PTC RESET FUSE 6V 500MA 0805; Manufacturer Part Number: 0805L050WR; Manufacturer: Littelfuse; Current Rating: 100A; Hold Current: 0.5A; Value: 0.15-0.85Ω; Trip Time: 0.1s; Trip Current: 1A; Device Class L2: PTC Resettable Fuses; Digikey Description: PTC RESET FUSE 6V 500MA 0805; ComponentLink2URL: https://www.littelfuse.com/~/media/electronics/datasheets/resettable_ptcs/littelfuse_ptc_0805l_datasheet.pdf.pdf; Package: 0805L; RoHS: TRUE; Temperature Range Low: -40°C; Octopart: https://octopart.com/0805l050wr-littelfuse-673858; Resistance: 0.15-0.85Ω; ComponentLink2Description: Datasheet; Category: Fuse; Height: 1.25mm; Mouser Description: PTC Resettable Fuse 0.5A(hold) 1A(trip) 6VDC 100A 0.5W 0.1s 0.15Ohm SMD Solder Pad 0805 T/R; Ambient Temperature Range High: +85°C; Automotive: No; Device Class L3: unset; Lead Free: Yes; Temperature: -40°C to +85°C; Voltage Rating: 6V; Ambient Temperature Range Low: -40°C; Temperature Range High: +85°C; Device Class L1: Circuit Protection
FB1 FB2 = CMP-0686-00187-4: Chip Ferrite Bead, 0402, 600Ω @ 100MHz, 0.52Ω, 25%, 300mA; Manufacturer: Murata; DC Resistance-Max: 600mR; Number of Lines: 1; DC Resistance (DCR): 520mR; Shielding: Unshielded; Impedance: 600R; Material: Steel; Frequency: 100MHz; Lead Free: Lead Free; Max DC Current: 300mA; Test Frequency: 100MHz; Depth: 0.55mm; Length: 1mm; Case Code (Imperial): 0402; Packaging: Tape and Reel; Height: 0.5mm; Max Operating Temperature: 125°C; Military Standard: Not; REACH SVHC: No SVHC; Case Code (Metric): 1005; Series: BLM15AG_SN; Core Material: Ferrite; Termination: SMD/SMT; DC Current: 300mA; Package Quantity: 10000; Width: 0.5mm; RoHS Compliant: Yes; Min Operating Temperature: -55°C; Current Rating: 300mA; Case/Package: 0402; Number of Pins: 2; Radiation Hardening: No; Tolerance: 25%; Number of Circuits: 1; Max Current Rating: 300mA; Manufacturer Part Number: BLM15AG601SN1D
J1 = CMP-03369-000056-1: CONN RCPT 30POS 0.1 GOLD PCB; Manufacturer Part Number: 6-534206-5; Manufacturer: TE Connectivity; Number Of Contacts: 30; Is Female: yes; Pitch: 2.54mm; Conn Gender: Female; Standoff Height: 0.38mm; Conn Orientation: Vertical; Current Rating: 2A; Lead Free: Yes; Category: Conn; Mouser Description: Headers & Wire Housings REC 2X15P VRT T/H; Device Class L3: unset; Height: 8.9mm; ComponentLink2Description: Datasheet; RoHS: TRUE; ComponentLink2URL: https://www.te.com/commerce/DocumentDelivery/DDEController?Action=showdoc&DocId=Specification+Or+Standard%7F114-25018%7FE%7Fpdf%7FEnglish%7FENG_SS_114-25018_E.pdf%7F6-534206-5; Temperature: -65°C to +105°C; Temperature Range Low: -65°C; Footprint Url: https://www.te.com/commerce/DocumentDelivery/DDEController?Action=showdoc&DocId=Customer+Drawing%7F534206%7FR7%7Fpdf%7FEnglish%7FENG_CD_534206_R7.pdf%7F6-534206-5; Contact Material: Gold,Nickel; Automotive: No; Package: 0; Device Class L2: Headers and Wire Housings; Device Class L1: Connectors; Temperature Range High: +105°C; Number Of Rows: 2; Digikey Description: CONN RCPT 30POS 0.1 GOLD PCB; Octopart: https://octopart.com/6-534206-5-te+connectivity-39516817
J2 = CMP-1502-01625-2: NexarPartId: 52645150; Contact Resistance: 50mΩ; Operating Supply Voltage: 50V; Gender: Receptacle; Current Rating: 500mA; Number of Positions: 10; Wire/Cable Type: Straight; Pitch: 500µm; Insulation Resistance: 500MΩ; Actuator Material: Nylon, Polyamide; Contact Plating: Tin; Termination: Solder; Number of Rows: 1; Orientation: Horizontal; Number of Pins: 10; REACH SVHC: Unknown; Housing Material: Nylon; Length: 5.6mm; Flammability Rating: UL94 V-0; Max Operating Temperature: 105°C; Mount: Surface Mount; Voltage Rating: 50V; Contact Material: Bronze; Min Operating Temperature: -40°C; Packaging: Tape and Reel; RoHS: Compliant; Lead Pitch: 500µm; Number of Contacts: 10
J3 = CMP-1241-00354-1: 0.5 mm Pitch Easy-On(TM) Type FPC Connector, 2.0 mm Mated Height, Right Angle, ZIF, SMT, Top Contact, 8 Circuits, -20 to 85 degC, ELV and RoHS Compliant, Tape and Reel; PartNumber: 52745-0897; Manufacturer: Molex; Material - Plating Mating: Gold; Stackable: No; Material - Metal: Phosphor Bronze; PCB Retention: Yes; Mated Height: 2.00mm; Durability (mating cycles max): 20; Circuits (Loaded): 8; Current (Max per Contact): 0.5A; Pitch - Mating Interface: 0.50mm; Voltage (Max): 50V; Entry Angle: 90degrees Angle; Mounting Technology: Surface Mount; Packing: Tape and Reel; ComponentLink3URL: http://www.molex.com/pdm_docs/sd/527450897_sd.pdf; ComponentLink2URL: http://www.molex.com/webdocs/datasheets/pdf/en-us/0527450897_FFC_FPC_CONNECTORS.pdf; PackageVersion: Rev. C, 07/2010; PackageReference: 52745-0897; Contact Position: Top; Orientation: Right Angle; ComponentLink1Description: Manufacturer URL; ComponentLink2Description: Datasheet; Material - Plating Termination: Gold; Number of Rows: 1; PackageDescription: 8-Lead FPC Connector, Pitch 0.5 mm; ComponentLink3Description: Package Specification; ComponentLink1URL: http://www.molex.com/molex/index.jsp; Polarized to PCB: Yes; PCB Locator: No; RoHS: TRUE; Manufacturer Part Number: 52745-0897
J4 = CMP-17439-000004-1: CONN HEADER R/A 4POS 1.5MM; Manufacturer: JST; Conn Gender: Male; Conn Orientation: Right Angle; Number Of Contacts: 4; Voltage Rating: 50V; Current Rating: 1A; Device Class L3: unset; Number Of Rows: 1; Category: Conn; ComponentLink2URL: http://www.jst-mfg.com/product/pdf/eng/eZH.pdf; Height: 3.7mm; Pitch: 1.5mm; Device Class L1: Connectors; Octopart: https://octopart.com/s4b-zr%28lf%29%28sn%29-jst-248835; Package: S4B-ZR(LF)(SN); Temperature: -25°C to +85°C; Digikey Description: CONN HEADER R/A 4POS 1.5MM; Contact Material: Tin; Manufacturer Part Number: S4B-ZR(LF)(SN); Temperature Range High: +85°C; Automotive: No; Temperature Range Low: -25°C; Lead Free: Yes; RoHS: TRUE; ComponentLink2Description: Datasheet; Device Class L2: Headers and Wire Housings
J5 = CMP-17439-000179-1: CONN WIRE HDR 2POS 1MM STSMD; Manufacturer: JST; Mated Stacking Heights: 4.9mm; Max Current Rating: 1A; Pitch: 0.039inch; Contact Resistance: 20mR; Max Voltage Rating (DC): 50V; Connector Type: Header; Number of Positions: 2; Insulation Material: Nylon; Termination: Solder; Contact Plating: Tin; Mount: Surface Mount; Package Quantity: 1500; Housing Color: Natural; Orientation: Straight; Max Operating Temperature: 85°C; Min Operating Temperature: -25°C; Length: 4mm; Lead Free: Lead Free; Contact Type: Male Pin; Depth: 3.6mm; Contact Material: Copper Alloy; Packaging: Tape and Reel; Number of Rows: 1; Contact Shape: Square; Flammability Rating: UL94 V-0; Voltage Rating: 50V; Color: Natural; Contact Finish - Mating: TIN; Fastening Type: Pull; Insulation Color: Natural; Series: SR; Max Voltage Rating (AC): 50V; Housing Material: Polyamide; Manufacturer Part Number: BM02B-SRSS-TBT(LF)(SN)
L1 = CMP-03913-14415874-1: 744901018 Fixed Ind 1.8NH 560MA 200MOHM Sm; Manufacturer: Wurth Electronics; Shielding: Unshielded; Q Factor: 13; Core Material: Alumina; Self Resonant Frequency: 10GHz; DC Resistance (DCR): 140mΩ; Test Frequency: 500MHz; Length: 1mm; RoHS: Compliant; REACH SVHC: No SVHC; Current Rating: 560mA; Case Code (Metric): 1005; Number of Pins: 2; Mount: Surface Mount; Max Operating Temperature: 125°C; Max DC Current: 560mA; Packaging: Digi-Reel®; Height - Seated (Max): 406.4µm; Width: 500µm; Height: 320µm; Case/Package: 0402; Case Code (Imperial): 0402; Composition: Thin Film; NexarPartId: 14415874; Min Operating Temperature: -40°C; Inductance: 1.8nH; Manufacturer Part Number: 744901018
L2 L3 = CMP-1393-00018-2: NexarPartId: 30848167; Manufacturer: Wurth Electronics; Manufacturer Part Number: 74438335022; Shielding: Shielded; Inductance: 2.2µH; DC Resistance (DCR): 94mΩ; Saturation Current: 3.5A; Inductance Tolerance: 20%; Self Resonant Frequency: 45MHz; Max DC Current: 1.8A; Core Material: Composite, Ferrite, Metal; Test Frequency: 100kHz; Packaging: Cut Tape (CT); RoHS: Compliant; Max Operating Temperature: 125°C; Min Operating Temperature: -40°C; REACH SVHC: Unknown; Number of Pins: 2; Height - Seated (Max): 1.4986mm; Case/Package: SMD/SMT; Width: 3mm; Height: 1.5mm; Ambient Temperature Range Low: -40°C; Termination: SMD/SMT; Mount: Surface Mount; RMS Current (Irms): 1.8A; Depth: 3mm; Tolerance: 20%; Series Resistance: 94mΩ; Case Code (Imperial): 1212; Case Code (Metric): 3030; Current Rating: 1.8A; Length: 3mm; Ambient Temperature Range High: 85°C
L4 = CMP-1662-00028-2: Multilayer Type Inductor for Power Lines, 1008 (2520), 2.2μH, 20%, 0.1Ω, 1.3A; Manufacturer: Murata; Manufacturer Part Number: LQM2HPN2R2MG0L; Core Material: Ferrite; DC Resistance (DCR): 100mR; Test Frequency: 1MHz; Self Resonant Frequency: 40MHz; Shielding: Shielded; Depth: 2.2mm; Length: 2.5mm; Max DC Current: 1.3A; Military Standard: Not; Current Rating: 1.3A; Termination: SMD/SMT; Radiation Hardening: No; Tolerance: 20%; Height: 1.2mm; Case Code (Metric): 2520; DC Current: 1.3A; Inductance Tolerance: 20%; Packaging: Tape and Reel; Width: 2mm; REACH SVHC: No SVHC; Mount: Surface Mount; Inductance: 2.2uH; Max Operating Temperature: 125°C; Lead Free: Lead Free; Case/Package: 1008; Case Code (Imperial): 1008; Series: LQM2HP_G0; Height - Seated (Max): 0.039inch; Package Quantity: 3000; Min Operating Temperature: -55°C
LED1 = CMP-08952-000015-1: LED GREEN CLEAR 1006 SMD; Manufacturer Part Number: SML-P13PTT86R; Manufacturer: Rohm; Power Dissipation: 52mW; Forward Current: 20mA; Reverse Voltage: 5V; Led Orientation: Top View; Forward Voltage: 2.1V; Luminous Intensity: 10mcd; Wavelength: 560nm; Temperature: -40°C to +85°C; Digikey Description: LED GREEN CLEAR 1006 SMD; Lead Free: Yes; Height: 0.25mm; Package: SML-P1; RoHS: TRUE; Mouser Description: LED Uni-Color Green 2-Pin Chip 0402(1006Metric) T/R; Device Class L2: LEDs; ComponentLink2URL: https://d1d2qsbl8m0m72.cloudfront.net/en/products/databook/datasheet/opto/led/chip_mono/sml-p1-e.pdf; Device Class L1: Optoelectronics; ComponentLink2Description: Datasheet; Category: Diode; Temperature Range High: +85°C; Automotive: No; Temperature Range Low: -40°C; Octopart: https://octopart.com/sml-p13ptt86r-rohm-59370256; Device Class L3: unset; Colour: Green
p1 p2 = 2Pin SMD pad
Q1 Q2 = CMP-20235-000001-1: NPN TRANSISTOR 1.5A 40V SOT-23 R; Manufacturer: Comchip; Manufacturer Part Number: SS8050-G; Transition Frequency: 100MHz; Max Breakdown Voltage: 25V; Collector Emitter Voltage (VCEO): 400mV; Max Power Dissipation: 300mW; Max Collector Current: 1.5A; Case/Package: TO-236-3; Packaging: Tape and Reel; RoHS Compliant: Yes; Mount: Surface Mount; Collector Emitter Breakdown Voltage: 25V
R1-R3 R7-R9 R11 R14-R17 R19 R26 R35 R53 = CMP-2002-00759-4: RES SMD 20K OHM 1% 1/10W 0402; Manufacturer: Panasonic; Manufacturer Part Number: ERJ-2RKF2002X; Resistance: 20kR; Voltage Rating (DC): 50V; Power Rating: 100mW; Temperature Coefficient: 100ppm/°C; Radiation Hardening: No; Case/Package: 0402; Case Code (Metric): 1005; Min Operating Temperature: -55°C; Termination: SMD/SMT; Package Quantity: 1; Length: 1mm; Case Code (Imperial): 0402; Lead Free: Lead Free; Height: 0.35mm; Max Operating Temperature: 155°C; Depth: 0.5mm; Number of Terminations: 2; Military Standard: Not; Max Power Dissipation: 100mW; Tolerance: 1%; Composition: Thick Film; Weight: 2.8E-05oz; Features: Automotive AEC-Q200; Voltage Rating: 50V; Contact Plating: Tin; REACH SVHC: No SVHC; Width: 0.02inch; Packaging: Cut Tape; Mount: Surface Mount
R4 R5 R10 R12 R18 R20-R25 R27-R34 R36-R52 R54-R57 R59 R60 = CMP-1011-00360-3: RES SMD 47 OHM 1% 1/10W 0402; Manufacturer: Vishay Dale; Manufacturer Part Number: CRCW040247R0FKTD; Resistance: 47R; Power Rating: 100mW; Temperature Coefficient: 100ppm/°C; Voltage Rating (DC): 50V; Case Code (Imperial): 0402; Width: 0.02inch; Height: 0.35mm; Features: Automotive AEC-Q200; Case/Package: 0402; RoHS Compliant: Yes; Lead Free: Lead Free; Case Code (Metric): 1005; Technology: THICK FILM; Termination: SMD/SMT; Tolerance: 1%; Resistance Tolerance: 1%; Max Operating Temperature: 155°C; Construction: Rectangular; Mount: Surface Mount; Min Operating Temperature: -55°C; Max Power Dissipation: 100mW; Number of Terminations: 2; Military Standard: Not; REACH SVHC: No SVHC; Resistor Type: Thick Film; Contact Plating: Tin; Package Quantity: 1; Series: ERJ; Packaging: Tape and Reel; Voltage Rating: 50V; Weight: 2.8E-05oz; Length: 1mm; Number of Pins: 2; Depth: 0.5mm
R6 = CMP-2002-05265-2: Thick Film Chip Resistors 0402 51Ω 0.0625W 1% 100ppm/°C; Manufacturer: Bourns; Manufacturer Part Number: CR0402-FX-51R0GLF; Voltage Rating: 50V; Power Rating: 62.5mW; Resistance: 51R; Max Power Dissipation: 63mW; Contact Plating: Tin; Termination: SMD/SMT; Min Operating Temperature: -55°C; Package Quantity: 10000; Max Operating Temperature: 125°C; Length: 1mm; Depth: 0.5mm; Case Code (Imperial): 0402; Packaging: Tape and Reel; Case Code (Metric): 1005; Radiation Hardening: No; Thickness: 356um; Composition: Thick Film; Width: 0.02inch; Case/Package: 0402; Height: 0.016inch; Temperature Coefficient: 100ppm/°C; Mount: Surface Mount; Tolerance: 1%; Number of Terminations: 2; Military Standard: Not
R13 = CMP-26527-000100-1: 200kΩ ±1% 0.063W 0402 Thick Film Chip Resistor AEC-Q200 compliant; Manufacturer: Stackpole Electronics; Manufacturer Part Number: RMCF0402FT200K; Resistance: 200kR; Temperature Coefficient: 100ppm/°C; Power Rating: 63mW; Size Code: 0402; Case Code (Imperial): 0402; Resistor Type: Thick Film; Contact Plating: Tin; Width: 0.02inch; Height: 0.016inch; Case/Package: 0402; Mount: Surface Mount; Min Operating Temperature: -55°C; Series: RMCF; Number of Terminations: 2; RoHS Compliant: Yes; Case Code (Metric): 1005; Packaging: Tape and Reel; Length: 0.039inch; Features: Automotive AEC-Q200; Lead Free: Lead Free; Radiation Hardening: No; Tolerance: 1%; Max Power Dissipation: 63mW; Max Operating Temperature: 155°C
R58 = CMP-2002-07520-1: Manufacturer: Yageo; Part Number: RC0402FR-0722RL; Manufacturer Part Number: RC0402FR-0722RL
SW1 SW2 = CMP-05618-000046-1: SWITCH TACTILE SPST-NO 0.05A 12V; Manufacturer: Panasonic; Current Rating: 50mA; Operating Force: 2.2N; Actuator Color: Black; Mechanical Life: 100000Cycles; Switch Function: Off-Mom; Switch Travel: 0.3mm; Throw Configuration: SPST; Contact Resistance: 500mR; Illumination Type: Non-Illuminated; Actuator Length: 1mm; Mount: Surface Mount; Contact Plating: Silver; Series: EVQPU; Packaging: Tape and Reel; Height: 1.65mm; Radiation Hardening: No; Termination: Gull Wing; Depth: 4.5mm; Max Operating Temperature: 70°C; RoHS Compliant: Yes; Contact Current Rating: 50mA; Length: 6.4mm; Electrical Life: 100000Cycles; Max Voltage Rating (DC): 12V; Package Quantity: 1; Width: 3.5mm; Min Operating Temperature: -40°C; Max Current Rating: 50mA; Orientation: Straight; Voltage Rating (DC): 12V; Size: 3.5mm; Lead Free: Lead Free; Manufacturer Part Number: EVQ-PUC02K
TP1-TP7 = CMP-00028-00002-2: 0.6mm round; Pins: 1; Component Type: Mechanical
U1 = CMP-194065-000007-1: IC RF TXRX+MCU BLUETOOTH 48VFQFN; Manufacturer: Espressif Systems; Memory Size: 520KB; Current - Receiving: 100mA; Current - Transmitting: 240mA; Interface: I2C; Sensitivity: -98dBm; Frequency: 2.4GHz; Data Rate: 150Mbps; Number of GPIO: 34; Min Operating Temperature: -40°C; Max Operating Temperature: 125°C; Packaging: Tape and Reel; Manufacturer Part Number: ESP32-D0WDQ6
U2 = CMP-08107-000004-1: IC SGL USB-TO-UART BRIDGE 24QFN; Manufacturer: Silicon Labs; Max Supply Voltage: 3.6V; Min Supply Voltage: 1.8V; Nominal Supply Current: 100-17000uA; Standoff Height: 0mm; Interface: UART,USB; Temperature Range Low: -40°C; Lead Free: Yes; Device Class L3: Controllers; Ambient Temperature Range Low: -55°C; Automotive: No; Category: IC; Temperature: -40°C to +85°C; Octopart: https://octopart.com/cp2104-f03-gmr-silicon+labs-19668642; Ambient Temperature Range High: +125°C; Package: CP2104-F03-GMR; Device Class L2: Interface ICs; Digikey Description: IC SGL USB-TO-UART BRIDGE 24QFN; Device Class L1: Integrated Circuits (ICs); Manufacturer Part Number: CP2104-F03-GMR; Temperature Range High: +85°C; ComponentLink2URL: https://www.silabs.com/documents/public/data-sheets/cp2104.pdf; Height: 0.8mm; Ipc Land Pattern Name: QFN50P400X400X75-24; Mouser Description: I/O Controller Interface IC USB to UART bridge; ComponentLink2Description: Datasheet; RoHS: TRUE
U3 = AXP192: Integrated Circuit; Manufacturer_Name: X-Powers; Datasheet Link: http://www.x-powers.com/en.php/Info/down/id/50; Height: 0.92mm; Manufacturer_Part_Number: AXP192
U4 = SY7088DGC: LED; Manufacturer_Name: Silergy; Datasheet Link: https://datasheet.lcsc.com/szlcsc/Silergy-Corp-SY7088DGC_C178240.pdf; Height: 0.9mm; Manufacturer_Part_Number: SY7088DGC
U5 = ESP-PSRAM64H: 64 Mbit serial pseudo SRAM; ComponentLink1Description: Datasheet; ComponentLink1URL: https://www.espressif.com/sites/default/files/documentation/esp-psram64_esp-psram64h_datasheet_en.pdf
U6 = CMP-05698-000018-1: IC AMP CLASS D MONO 3.2W 16TQFN; Manufacturer: Maxim; Max Supply Voltage: 5.5V; Max Output Current: 1.6A; Voltage Gain: 15dB; Max Power Dissipation: 1.666W; Min Supply Voltage: 2.5V; Power Supply Rejection Ratio (PSRR): 77dB; Series: -; Contact Plating: Tin; Min Operating Temperature: -40°C; Packaging: Tape and Reel; Max Output Power: 3.2W; Mount: Surface Mount; Number of Pins: 16; RoHS Compliant: Yes; Max Operating Temperature: 85°C; Radiation Hardening: No; Manufacturer Part Number: MAX98357AETE+T
u7 = SPI_Flash_MT25QL128ABA1ESE-0SIT: 3V 128M-BIT / SERIAL NOR FLASH MEMORY; ComponentLink1Description: Datasheet; ComponentLink1URL: https://www.farnell.com/datasheets/2712422.pdf?src-supplier=Farnell
U8 = CMP-10083-000003-1: IC RTC CLK/CALENDAR I2C 8-SOIC; Manufacturer: NXP Semiconductors; Manufacturer Part Number: PCF8563T/F4,118; Nominal Supply Current: 0.225-0.95uA; Standoff Height: 0.1mm; Max Supply Voltage: 5.5V; Interface: I2C,2-Wire; Number Of Outputs: 1; Frequency: 32.768kHz; Min Supply Voltage: 1V; Package: SOT96-1; RoHS: TRUE; Device Class L2: Clock and Timing; ComponentLink2URL: https://www.nxp.com/docs/en/data-sheet/PCF8563.pdf; Ambient Temperature Range Low: -40°C; Ipc Land Pattern Name: SOIC127P600X175-8; Digikey Description: IC RTC CLK/CALENDAR I2C 8-SOIC; Device Class L1: Integrated Circuits (ICs); Ambient Temperature Range High: +85°C; Mouser Description: Real Time Clock ULTRA LO PWR CLK/CAL; Device Class L3: Real Time Clocks; Automotive: No; Octopart: https://octopart.com/pcf8563t%2Ff4%2C118-nxp+semiconductors-10476398; Footprint Url: https://www.nxp.com/docs/en/package-information/SOT96-1.pdf; Height: 1.75mm; Lead Free: Yes; ComponentLink2Description: Datasheet; Category: IC
USB_C1 = TypeC_cntr: Generic typeC connector
X1 = CMP-27762-003430-2: Crystal 32.768kHz ±10ppm (Tol) 9pF FUND 90kΩ 2-Pin Mini-CSMD T/R; Manufacturer: Abracon; Manufacturer Part Number: ABS06-32.768KHZ-9-1-T; Series Resistance: 90kR; Series: ABS06; Case/Package: CSMD; Package Quantity: 3000; Load Capacitance: 9pF; Number of Pins: 2; Tolerance: 10ppm; RoHS Compliant: Yes; Depth: 1.2mm; Termination: SMD/SMT; Min Operating Temperature: -40°C; Length: 2mm; Packaging: Tape and Reel; Max Operating Temperature: 85°C; Frequency Tolerance: 10ppm; Width: 1.2mm; ESR (Equivalent Series Resistance): 90kR; Radiation Hardening: No; Frequency: 32.768kHz; REACH SVHC: No SVHC; Mount: Surface Mount; Height: 0.6mm
X2 = CMP-27762-008947-1: Crystal 40MHz ±10ppm 10pF SMD-4 3.2mm x 2.5mm; Manufacturer: Abracon; Manufacturer Part Number: ABM8-40.000MHZ-10-1-U-T; ESR (Equivalent Series Resistance): 35R; Frequency: 40MHz; Number of Pins: 4; Frequency Stability: 10ppm; Radiation Hardening: No; Tolerance: 10ppm; Min Operating Temperature: -10°C; Resistor Type: Ceramic; Width: 0.098inch; Max Operating Temperature: 60°C; Case/Package: SMD/SMT; Packaging: Tape and Reel; Mount: Surface Mount; Termination: SMD/SMT; Load Capacitance: 10pF; Series: ABM8; Height: 0.031inch; Frequency Tolerance: 10ppm; Operating Frequency: 40 MHz; Package Quantity: 1000; Length: 0.126inch; Lead Free: Lead Free